# Altium project ZUM_Junior.PrjPcb
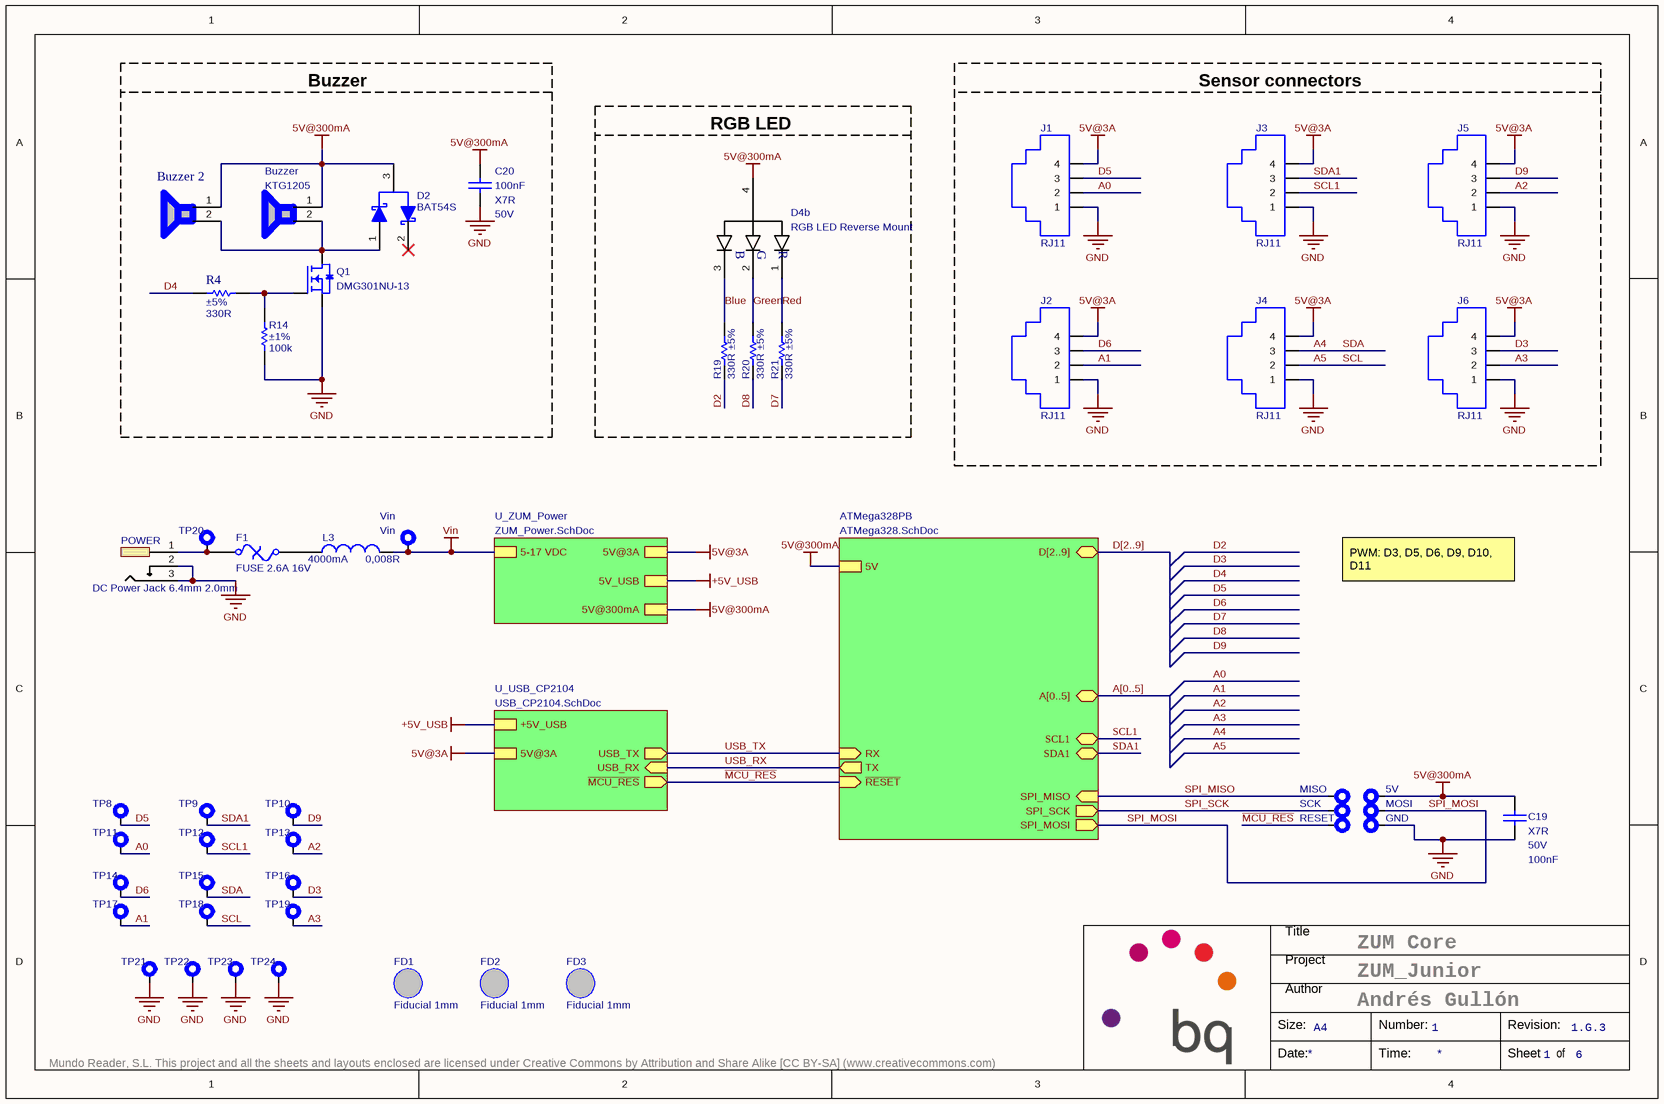
[diagram p0: ZUM_Junior.SchDoc]
ItemRevision: 1.G.3; ProjectName: ZUM_Junior; SilkscreenColor: White; SoldermaskColor: Blue; SurfaceFinish: Immersion Tin
6 sheets, 116 parts. Net scope: hierarchical (ports join the sheet entries above them; power ports are global).
Board file: ZUM_Junior.PcbDoc
Sheets:
  ZUM_Junior.SchDoc
    ATMega328PB = ATMega328.SchDoc
    U_USB_CP2104 = USB_CP2104.SchDoc
    U_ZUM_Power = ZUM_Power.SchDoc
      MP1477H_DCDC_5V = MP1477H_DCDC_5V.SchDoc
      MP2019_LDO_5V = MP2019_LDO_5V.SchDoc

## Sheet ZUM_Junior.SchDoc: ZUM Core
size A4; Author: Andrés Gullón; DocumentNumber: 1; Revision: 1.G.3; SheetNumber: 1; SheetTotal: 6

### Parts
Buzzer  KTG1205  [BUZZER SMD 13mm]
Buzzer_2  Buzzer 8.5mm SMD  [YX-8014S05-2.7]  (value not drawn)
C19  Dielectric: X7R  Voltage: 50V  Capacitance: 100nF  [C0603]  (hidden comment: C0603_100nF_50V_±10%_X7R)
C20  Dielectric: X7R  Voltage: 50V  Capacitance: 100nF  [C0603]  (hidden comment: C0603_100nF_50V_±10%_X7R)
D2  BAT54S  [SOT23-3]
D4b  RGB LED Reverse Mount  [LED1205 Reverse]
F1  FUSE 2.6A 16V  [F1812]
FD1  Fiducial 1mm  [Fiducial_1mm]  (no BOM)
FD2  Fiducial 1mm  [Fiducial_1mm]  (no BOM)
FD3  Fiducial 1mm  [Fiducial_1mm]  (no BOM)
J1  RJ11  [RJ11 SMD]
J2  RJ11  [RJ11 SMD]
J3  RJ11  [RJ11 SMD]
J4  RJ11  [RJ11 SMD]
J5  RJ11  [RJ11 SMD]
J6  RJ11  [RJ11 SMD]
L3  Resistance_DC: 0,008R  Current: 4000mA  [L0805]  (hidden comment: L0805_33R_0,008R_4000mA)
POWER  DC Power Jack 6.4mm 2.0mm  [694106106102]
Q1  DMG301NU-13  [SOT23-3]
R4  Tolerance: ±5%  Resistance: 330R  [R0402]  (hidden comment: R0402_330R_0.063W_±5%)
R14  Tolerance: ±1%  Resistance: 100k  [R0402]  (hidden comment: R0402_100k_0.063W_±1%)
R19  Tolerance: ±5%  Resistance: 330R  [R0402]  (hidden comment: R0402_330R_0.063W_±5%)
R20  Tolerance: ±5%  Resistance: 330R  [R0402]  (hidden comment: R0402_330R_0.063W_±5%)
R21  Tolerance: ±5%  Resistance: 330R  [R0402]  (hidden comment: R0402_330R_0.063W_±5%)
TP8  TP  [TP_POWER]  (value not drawn)  (no BOM)
TP9  TP  [TP_POWER]  (value not drawn)  (no BOM)
TP10  TP  [TP_POWER]  (value not drawn)  (no BOM)
TP11  TP  [TP_POWER]  (value not drawn)  (no BOM)
TP12  TP  [TP_POWER]  (value not drawn)  (no BOM)
TP13  TP  [TP_POWER]  (value not drawn)  (no BOM)
TP14  TP  [TP_POWER]  (value not drawn)  (no BOM)
TP15  TP  [TP_POWER]  (value not drawn)  (no BOM)
TP16  TP  [TP_POWER]  (value not drawn)  (no BOM)
TP17  TP  [TP_POWER]  (value not drawn)  (no BOM)
TP18  TP  [TP_POWER]  (value not drawn)  (no BOM)
TP19  TP  [TP_POWER]  (value not drawn)  (no BOM)
TP20  TP  [TP_POWER]  (value not drawn)  (no BOM)
TP21  TP  [TP_POWER]  (value not drawn)  (no BOM)
TP22  TP  [TP_POWER]  (value not drawn)  (no BOM)
TP23  TP  [TP_POWER]  (value not drawn)  (no BOM)
TP24  TP  [TP_POWER]  (value not drawn)  (no BOM)
TP25  MISO  [TP_POWER]  (no BOM)
TP26  5V  [TP_POWER]  (no BOM)
TP27  SCK  [TP_POWER]  (no BOM)
TP28  MOSI  [TP_POWER]  (no BOM)
TP29  GND  [TP_POWER]  (no BOM)
TP30  RESET  [TP_POWER]  (no BOM)
Vin  Vin  [TP_POWER]  (no BOM)

### Blocks framed on the sheet
Buzzer: Buzzer Buzzer_2 C20 D2 Q1 R4 R14
Sensor connectors: J1-J6
RGB LED: D4b R19-R21

### Sub-sheets
ATMega328PB = ATMega328.SchDoc: D[2..9] (bidir), A[0..5] (bidir), ~{RESET} (in), 5V, RX (in), TX (out), SPI_MOSI (out), SPI_MISO (in), SPI_SCK (out), SCL1 (bidir), SDA1 (bidir)
U_USB_CP2104 = USB_CP2104.SchDoc: ~{MCU_RES} (out), USB_TX (out), USB_RX (in), +5V_USB, 5V@3A
U_ZUM_Power = ZUM_Power.SchDoc: 5V@3A, 5V_USB, 5-17 VDC, 5V@300mA

### Nets
5V@3A: J1.4 J2.4 J3.4 J4.4 J5.4 J6.4 ; sheet U_USB_CP2104/5V@3A, sheet U_ZUM_Power/5V@3A
5V@300mA: Buzzer.1 Buzzer_2.1 C19.2 C20.2 D2.3(K1) D4b.4 TP26.1 ; sheet ATMega328PB/5V, sheet U_ZUM_Power/5V@300mA  [project net 5V]
+5V_USB: sheet U_USB_CP2104/+5V_USB, sheet U_ZUM_Power/5V_USB
GND: C19.1 C20.1 J1.1 J2.1 J3.1 J4.1 J5.1 J6.1 POWER.2 POWER.3 Q1.2(S) R14.1 TP21.1 TP22.1 TP23.1 TP24.1 TP29.1
Vin: L3.2 Vin.1 ; sheet U_ZUM_Power/5-17 VDC
A0: J1.2 TP11.1
A1: J2.2 TP17.1
A2: J5.2 TP13.1
A3: J6.2 TP19.1
A4: J4.3 TP15.1  [also labelled SDA]
A5: J4.2 TP18.1  [also labelled SCL]
Blue: D4b.3(B) R19.2
D2: R19.1
D3: J6.3 TP16.1
D4: R4.1
D5: J1.3 TP8.1
D6: J2.3 TP14.1
D7: R21.1
D8: R20.1
D9: J5.3 TP10.1
Green: D4b.2(R) R20.2
~{MCU_RES}: TP30.1 ; sheet ATMega328PB/~{RESET}, sheet U_USB_CP2104/~{MCU_RES}
Red: D4b.1(G) R21.2
SCL1: J3.2 TP12.1 ; sheet ATMega328PB/SCL1
SDA1: J3.3 TP9.1 ; sheet ATMega328PB/SDA1
SPI_MISO: TP25.1 ; sheet ATMega328PB/SPI_MISO
SPI_MOSI: TP28.1 ; sheet ATMega328PB/SPI_MOSI
SPI_SCK: TP27.1 ; sheet ATMega328PB/SPI_SCK
USB_RX: sheet ATMega328PB/TX, sheet U_USB_CP2104/USB_RX  [project net TX]
USB_TX: sheet ATMega328PB/RX, sheet U_USB_CP2104/USB_TX  [project net RX]
NetBuzzer_2: Buzzer.2 Buzzer_2.2 D2.1(A) Q1.3(D)
NetF1_1: F1.1 POWER.1 TP20.1
NetF1_2: F1.2 L3.1
NetQ1_1: Q1.1(G) R4.2 R14.2

Not connected (* = marked no-connect by the designer): D2 2(K2)*

### Buses and harness runs
bus A[0..5] = sheet ATMega328PB/A[0..5]
bus D[2..9] = sheet ATMega328PB/D[2..9]

### Notes on the sheet
- PWM: D3, D5, D6, D9, D10, D11
- Title
- Project
- Size:
- Author
- A4
- Number:
- Revision:
- Mundo Reader, S.L. This project and all the sheets and layouts enclosed are licensed under Creative Commons by Attribution and Share Alike [CC BY-SA] (www.creativecommons.com)
- Date:
- Time:
- Sheet
- of

### Library data of the parts
Buzzer = CMP-00356-1: Buzzer; Manufacturer: Kingstate Elect.; Description ES: Zumbador; Temp_Max: 85; Temp_Min: 30; SchLibComponentName: BUZZER; Part Number: KTG1205; OrderingCode: KTG1205; Price units: EUR
Buzzer_2 = CMP-00368-3: Manufacturer: Qinlon; Description ES: Zumbador SMD 9.5mm; OrderingCode: YX-8014S-05; Temp_Max: 70; Temp_Min: -30; Part Number: YX-8014S-05; Value: Buzzer
C19 C20 = CMP-00257-1: Manufacturer: Kemet; Description ES: Condensador; OrderingCode: C0603C104K5RAC; OrderingCode 2: 06035C104KAT2A; SchLibComponentName: Capacitor; Temp_ Max: 125; Temp_ Min: -55; Tolerance: ±10%; Value: 100nF ±10% 50V; Manufacturer 2: AVX; Part Number: C0603_100nF_50V_±10%_X7R; Price units: EUR
D2 = CMP-A2299-1: Schottky Diode; Manufacturer: NXP; SchLibComponentName: Dual Schottky; Ifor: 200mA; Vrrm: 30V; Ifsm: 600mA; Vf: 0,8V; Description ES: Diodo Schottky; Temp_Max: 150; Temp_Min: -55; Lead time: 8 wks; Value: 200mA 30V; Part Number: BAT54S; OrderingCode: BAT54S; Supplier cod: AC1190; Price units: EUR; Manufacturer 2: Vishay; OrderingCode 2: BAT54S
D4b = CMP-00366-1: Manufacturer: WÜrth Elektronik; Description ES: LED RGB Montado del revés; OrderingCode: 156125M173000; Temp_Max: 85; Temp_Min: -40; Value: RGB LED Rev.; Part Number: RGB LED Reverse
F1 = CMP-A2427-2: Resettable Fuses; Part Number: FUSE 2.5A 16V; Manufacturer: Bel Fuse; Current: 2.5A; OrderingCode: 0ZCG0260BF2B; Description ES: Fusible reseteable; Temp_ Max: 85; Temp_ Min: -40; Lead time: 12 wks; OrderingCode 2: MINISMDC260F/16-2; OrderingCode 3: MF-MSMF250/16X-2; SchLibComponentName: PTC_Fuse; Voltage: 16V; Price units: EUR; Manufacturer 2: Littelfuse; Manufacturer 3: Bourns
FD1-FD3 = CMP-A2525-2: Fiducial; Description ES: Marca fiducial; SchLibComponentName: Fiducial; Part Number: Fiducial 1mm
J1-J6 = CMP-00353-5: RJ11 4p4c SMD; Manufacturer: Kycon; OrderingCode: GMX-SMT2-N-44-TR; OrderingCode 2: 7641 – T441; OrderingCode 4: 95501-6449; Temp_Max: 85; Temp_Min: -40; Description ES: RJ11 4p4c SMD; Manufacturer 2: Cenvalsa; Manufacturer 4: Molex; Part Number: RJ11; Price units: EUR
L3 = CMP-A0714-1: Manufacturer: Würth Elektronik; SchLibComponentName: Ferrite Bead; Resistance_100MHz: 33R; OrderingCode: 742792012; Temp_ Max: 125; Temp_ Min: -55; Value: 33R 0,008R 4000mA; Part Number: L0805_33R_0,008R_4000mA; Price units: EUR
POWER = CMP-00354-1: Manufacturer: Würth Elektronik; Temp_Max: 85; Temp_Min: -40; Value: DC Jack; Description ES: DC Power Jack 6.4mm 2.0mm; OrderingCode: 694106106102; Part Number: 694106106102; Price units: €
Q1 = CMP-A2386-5: N-MOSFET transistor; Manufacturer: Diodes; Vds: 25V; Vgss: 8V; Id: 0,26A; Description ES: Transistor MOSFET de canal N; Temp_ Max: 150; Temp_ Min: -55; SchLibComponentName: Mosfet_N; Part Number: DMG301NU-13; OrderingCode: DMG301NU-13; Price units: EUR
R4 R19-R21 = CMP-A1762-2: Manufacturer: Vishay; OrderingCode: CRCW0402330RJN; Power: 0.063W; Value: 330R ±5% 0.063W; Temp_ Max: 155; Temp_ Min: -55; Description ES: Resistencia; SchLibComponentName: Resistor; PackageDescription: SMD; Part Number: R0402_330R_0.063W_±5%; Price units: EUR
R14 = CMP-A1835-2: Manufacturer: Vishay; Value: 100k ±1% 0.063W; SchLibComponentName: Resistor; OrderingCode: CRCW0402100KFK; Power: 0.063W; Temp_ Max: 155; Temp_ Min: -55; Description ES: Resistencia; PackageDescription: SMD; Part Number: R0402_100k_0.063W_±1%; Price units: EUR
TP8-TP30 Vin = CMP-A2499-3: Testpoint 0.3mm; Manufacturer: Oxley; OrderingCode: SMOX/060/B1; SAP: 303552; SchLibComponentName: Testpoint; Part Number: TP_POWER; Price units: EUR

## Sheet ATMega328.SchDoc: ATMega328-PB
size A4; Author: Andrés Gullón; DocumentNumber: 2; Revision: 1.G.3; SheetNumber: 2; SheetTotal: 6
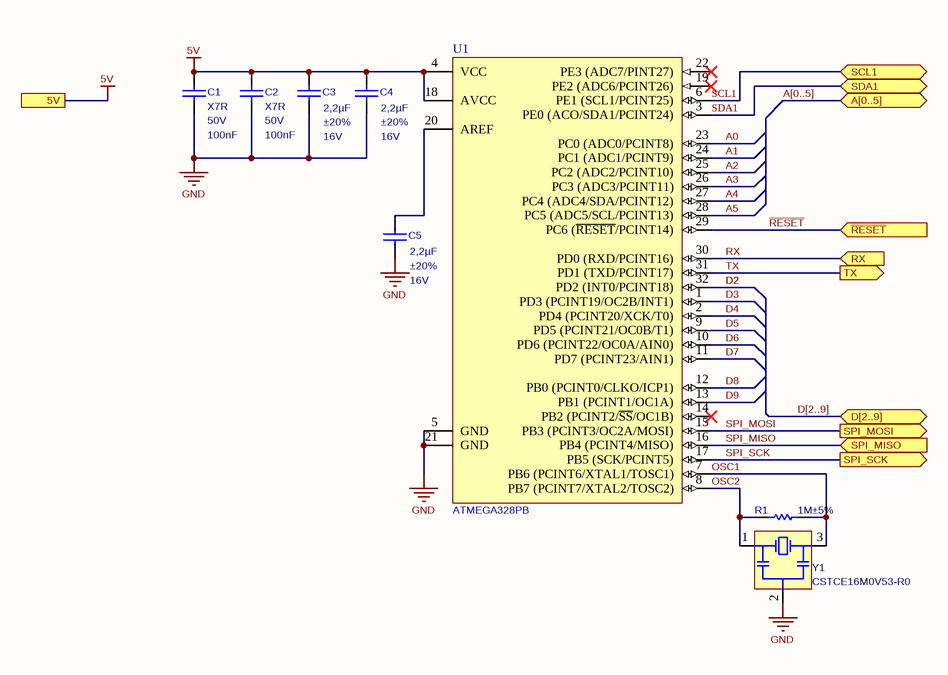
[diagram p1: ATMega328.SchDoc]

### Parts
C1  Dielectric: X7R  Voltage: 50V  Capacitance: 100nF  [C0603]  (hidden comment: C0603_100nF_50V_±10%_X7R)
C2  Dielectric: X7R  Voltage: 50V  Capacitance: 100nF  [C0603]  (hidden comment: C0603_100nF_50V_±10%_X7R)
C3  Voltage: 16V  Capacitance: 2,2µF  Tolerance: ±20%  [C0402]  (hidden comment: C0402_2.2uF_16V_±20%)
C4  Voltage: 16V  Capacitance: 2,2µF  Tolerance: ±20%  [C0402]  (hidden comment: C0402_2.2uF_16V_±20%)
C5  Voltage: 16V  Capacitance: 2,2µF  Tolerance: ±20%  [C0402]  (hidden comment: C0402_2.2uF_16V_±20%)
R1  Tolerance: ±5%  Resistance: 1M  [R0603]  (hidden comment: R0603_1M_0.1W_±5%)
U1  ATMEGA328PB  [TQFP32]
Y1  CSTCE16M0V53-R0  [Resonator_1.3x3.2]

### Ports
5V, A[0..5] (bidir), D[2..9] (bidir), RX (in), SCL1 (bidir), SDA1 (bidir), SPI_MISO (in), SPI_MOSI (out), SPI_SCK (out), TX (out), ~{RESET} (in)

### Nets
5V: C1.2 C2.2 C3.2 C4.2 U1.4(VCC) U1.18(AVCC) ; port 5V
GND: C1.1 C2.1 C3.1 C4.1 C5.1 U1.5(GND) U1.21(GND) Y1.2(GND)
A0: U1.23(PC0_(ADC0/PCINT8))
A1: U1.24(PC1_(ADC1/PCINT9))
A2: U1.25(PC2_(ADC2/PCINT10))
A3: U1.26(PC3_(ADC3/PCINT11))
A4: U1.27(PC4_(ADC4/SDA/PCINT12))
A5: U1.28(PC5_(ADC5/SCL/PCINT13))
D2: U1.32(PD2_(INT0/PCINT18))
D3: U1.1(PD3_(PCINT19/OC2B/INT1))
D4: U1.2(PD4_(PCINT20/XCK/T0))
D5: U1.9(PD5_(PCINT21/OC0B/T1))
D6: U1.10(PD6_(PCINT22/OC0A/AIN0))
D7: U1.11(PD7_(PCINT23/AIN1))
D8: U1.12(PB0_(PCINT0/CLKO/ICP1))
D9: U1.13(PB1_(PCINT1/OC1A))
OSC1: R1.1 U1.7(PB6_(PCINT6/XTAL1/TOSC1)) Y1.3(OSC2)
OSC2: R1.2 U1.8(PB7_(PCINT7/XTAL2/TOSC2)) Y1.1(OSC1)
~{RESET}: U1.29(PC6_(~{RESET}/PCINT14)) ; port ~{RESET}  [project net ~{MCU_RES}]
RX: U1.30(PD0_(RXD/PCINT16)) ; port RX
SCL1: U1.6(PE1_(SCL1/PCINT25)) ; port SCL1
SDA1: U1.3(PE0_(ACO/SDA1/PCINT24)) ; port SDA1
SPI_MISO: U1.16(PB4_(PCINT4/MISO)) ; port SPI_MISO
SPI_MOSI: U1.15(PB3_(PCINT3/OC2A/MOSI)) ; port SPI_MOSI
SPI_SCK: U1.17(PB5_(SCK/PCINT5)) ; port SPI_SCK
TX: U1.31(PD1_(TXD/PCINT17)) ; port TX
NetC5_2: C5.2 U1.20(AREF)

Not connected (* = marked no-connect by the designer): U1 14(PB2_(PCINT2/~{SS}/OC1B))* 19(PE2_(ADC6/PCINT26))* 22(PE3_(ADC7/PINT27))*

### Buses and harness runs
bus A[0..5] = port A[0..5]
bus D[2..9] = port D[2..9]

### Notes on the sheet
- Title
- Project
- Size:
- Author
- A4
- Number:
- Revision:
- Mundo Reader, S.L. This project and all the sheets and layouts enclosed are licensed under Creative Commons by Attribution and Share Alike [CC BY-SA] (www.creativecommons.com)
- Date:
- Time:
- Sheet
- of

### Library data of the parts
C1 C2 = CMP-00257-1: as C19 on sheet ZUM_Junior; Manufacturer 2: AVX; Part Number: C0603_100nF_50V_±10%_X7R; Price units: EUR
C3-C5 = CMP-A0550-4: C0402_2.2uF_16V_±20%_X5R; Part Number: C0402_2.2uF_16V_±10%; Manufacturer: TDK; Value: 2,2µF ±20% 16V; Dielectric: X5R; OrderingCode: C1005X5R1C225M050BC; Temp_ Max: 125; Temp_ Min: -55; AccessRights: 2147483647; ContentType: Component; Description ES: Condensador; Folder: Components Library\Pasives\Capacitor_SMD\C0402_16V$\; OrderingCode 2: EMK105ABJ225MV-F; RevisionId: 3; SchLibComponentName: Capacitor; Price units: EUR; ComponentType: Capacitor; ContentTypeGUID: CB3C11C4-E317-11DF-B822-12313F0024A2; FolderGUID: B1BE7916-43F7-4918-A273-F24409A7170B; ItemGUID: BD471B44-C1FF-4F80-85CC-AC0CC62DE9EE; ItemHRID: CMP-A0550; LifeCycle: New From Design; LifeCycleStateGUID: 706004B5-C76E-482E-903B-BA0E4FAE086A; Manufacturer 2: Taiyo Yuden; ReleaseDate: 04/09/2017 08:02:11 AM
R1 = CMP-A1358-3: Manufacturer: Vishay; OrderingCode: CRCW06031M00JN; Power: 0.1W; Value: 1M ±5% 0.1W; Temp_ Max: 155; Temp_ Min: -55; Description ES: Resistencia; SchLibComponentName: Resistor; PackageDescription: SMD; Part Number: R0603_1M_0.1W_±5%; Price units: EUR
U1 = CMP-00141-3: 8-bit Microcontrollers - MCU 32KB In-system Flash 20MHz 1.8V-5.5V; Manufacturer: Atmel; OrderingCode: ATMEGA328PB-AU; Description ES: Microcontrolador 8 bits; 32kB de memoria; Temp_ Max: 85; Temp_ Min: -40; Lead time: 3 wks; SchLibComponentName: ATMEGA328PB; Part Number: ATMEGA328PB; Supplier cod: AC1209; Price units: EUR
Y1 = CMP-A2241-1: Resonator 16MHz; Manufacturer: Murata; Description ES: Resonador 16MHz; Temp_Max: 80; Temp_Min: -20; Lead time: 10 wks; SchLibComponentName: Resonator 3 pin; Part Number: CSTCE16M0V53-R0; OrderingCode: CSTCE16M0V53-R0; Price units: EUR; Value: 16MHz

## Sheet USB_CP2104.SchDoc: CP2104 USB to Serial
size A4; Author: Andrés Gullón; DocumentNumber: 3; Revision: 1.G.3; SheetNumber: 3; SheetTotal: 6
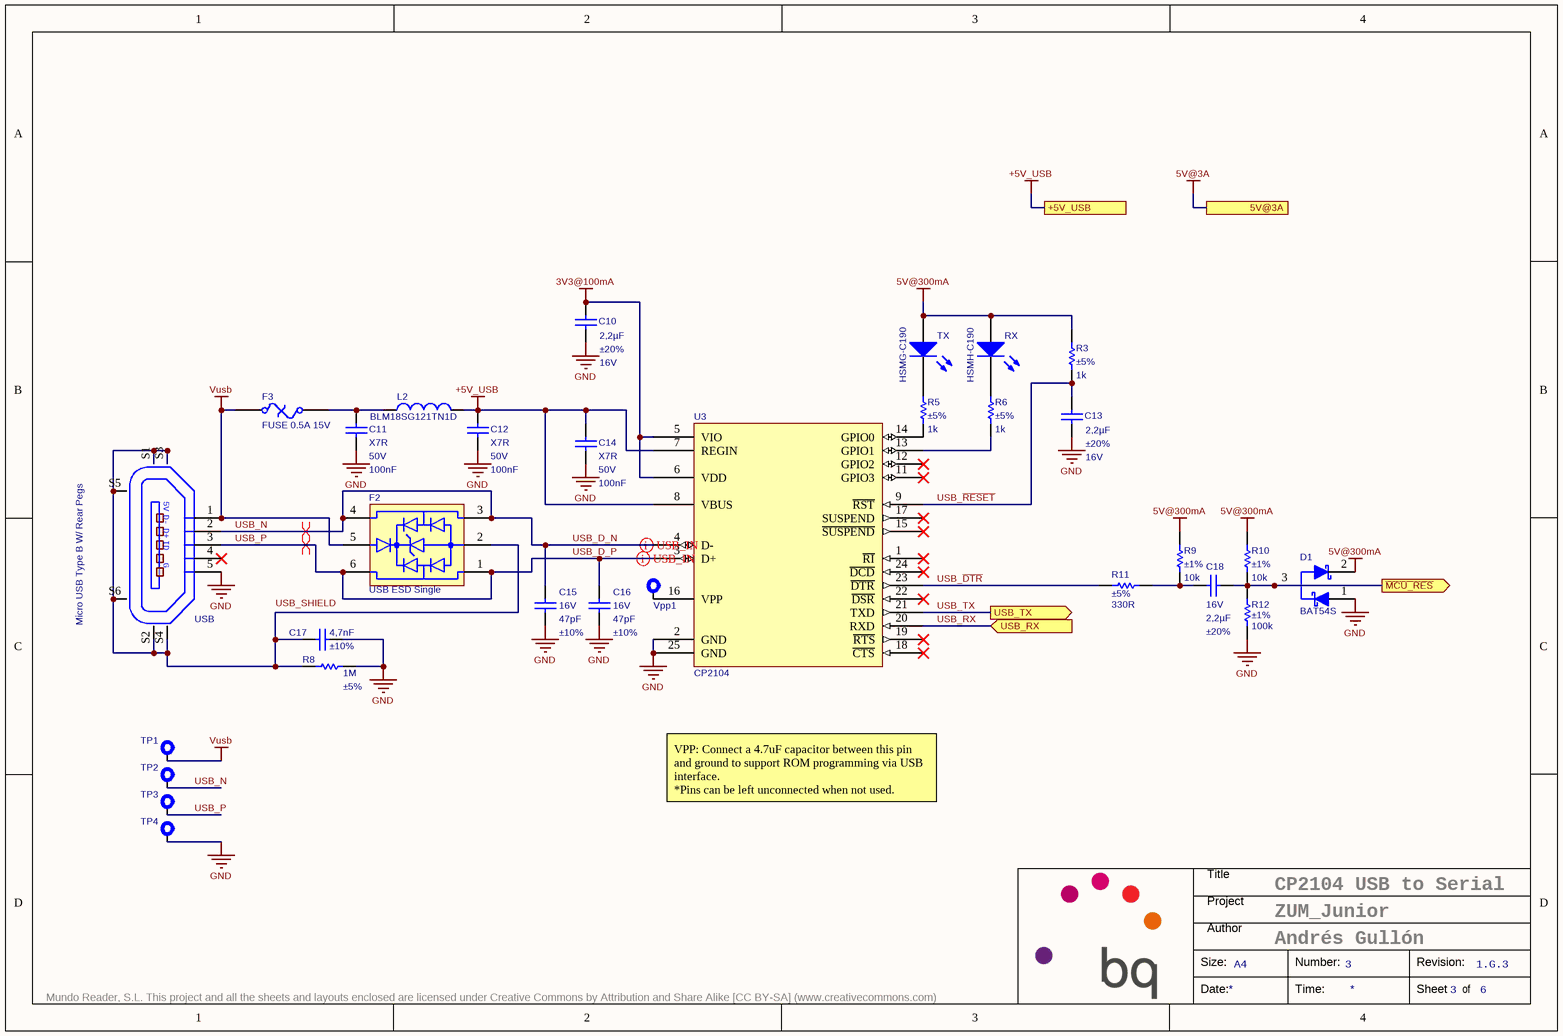
[diagram p2: USB_CP2104.SchDoc]

### Parts
C10  Voltage: 16V  Capacitance: 2,2µF  Tolerance: ±20%  [C0402]  (hidden comment: C0402_2.2uF_16V_±20%)
C11  Dielectric: X7R  Voltage: 50V  Capacitance: 100nF  [C0603]  (hidden comment: C0603_100nF_50V_±10%_X7R)
C12  Dielectric: X7R  Voltage: 50V  Capacitance: 100nF  [C0603]  (hidden comment: C0603_100nF_50V_±10%_X7R)
C13  Voltage: 16V  Capacitance: 2,2µF  Tolerance: ±20%  [C0402]  (hidden comment: C0402_2.2uF_16V_±20%)
C14  Dielectric: X7R  Voltage: 50V  Capacitance: 100nF  [C0603]  (hidden comment: C0603_100nF_50V_±10%_X7R)
C15  Voltage: 16V  Capacitance: 47pF  Tolerance: ±10%  [C0402]  (hidden comment: C0402_47pF_16V_±10%)
C16  Voltage: 16V  Capacitance: 47pF  Tolerance: ±10%  [C0402]  (hidden comment: C0402_47pF_16V_±10%)
C17  Capacitance: 4,7nF  Tolerance: ±10%  [C0805]  (hidden comment: C0805_4700pF_250V_±10%_X7R)
C18  Voltage: 16V  Capacitance: 2,2µF  Tolerance: ±20%  [C0402]  (hidden comment: C0402_2.2uF_16V_±20%)
D1  BAT54S  [SOT23-3]
F2  USB ESD Single  [SOT563]
F3  FUSE 0.5A 15V  [F1812]
L2  OrderingCode: BLM18SG121TN1D  [L0603]  (hidden comment: L0603_120R_0,025R_3000mA)
R3  Tolerance: ±5%  Resistance: 1k  [R0402]  (hidden comment: R0402_1k_0.063W_±5%)
R5  Tolerance: ±5%  Resistance: 1k  [R0402]  (hidden comment: R0402_1k_0.063W_±5%)
R6  Tolerance: ±5%  Resistance: 1k  [R0402]  (hidden comment: R0402_1k_0.063W_±5%)
R8  Tolerance: ±5%  Resistance: 1M  [R0603]  (hidden comment: R0603_1M_0.1W_±5%)
R9  Tolerance: ±1%  Resistance: 10k  [R0402]  (hidden comment: R0402_10k_0.063W_±1%)
R10  Tolerance: ±1%  Resistance: 10k  [R0402]  (hidden comment: R0402_10k_0.063W_±1%)
R11  Tolerance: ±5%  Resistance: 330R  [R0402]  (hidden comment: R0402_330R_0.063W_±5%)
R12  Tolerance: ±1%  Resistance: 100k  [R0402]  (hidden comment: R0402_100k_0.063W_±1%)
RX  HSMH-C190  [LED0603]
TP1  TP  [TP_POWER]  (value not drawn)  (no BOM)
TP2  TP_POWER  [TP_POWER]  (value not drawn)  (no BOM)
TP3  TP_POWER  [TP_POWER]  (value not drawn)  (no BOM)
TP4  TP_POWER  [TP_POWER]  (value not drawn)  (no BOM)
TX  HSMG-C190  [LED0603]
U3  CP2104  [QFN24_no_power]
USB  Micro USB Type B W/ Rear Pegs  [USB_B_W_REAR_PEGS]
Vpp1  TP_POWER  [TP_POWER]  (value not drawn)  (no BOM)

### Ports
5V@3A, +5V_USB, USB_RX (in), USB_TX (out), ~{MCU_RES} (out)

### Nets
3V3@100mA: C10.2 U3.5(VIO) U3.6(VDD)
5V@300mA: D1.2(K2) R3.2 R9.1 R10.1 RX.A TX.A  [project net 5V]
+5V_USB: C12.2 C14.2 L2.2 U3.7(REGIN) U3.8(VBUS) ; port +5V_USB
GND: C10.1 C11.1 C12.1 C13.1 C14.1 C15.1 C16.1 C17.2 D1.1(A) R8.1 R12.2 TP4.1 U3.2(GND) U3.25(GND) USB.5(P5)
Vusb: F2.5 F3.1 TP1.1 USB.1(P1)
~{MCU_RES}: C18.1 D1.3(K1) R10.2 R12.1 ; port ~{MCU_RES}
USB_~{DTR}: R11.1 U3.23(~{DTR})
USB_D_N: C15.2 F2.3 F2.4 TP2.1 U3.4(D-) USB.2(P2)  [also labelled USB_N]
USB_D_P: C16.2 F2.1 F2.6 TP3.1 U3.3(D+) USB.3(P3)  [also labelled USB_P]
USB_~{RESET}: C13.2 R3.1 U3.9(~{RST})
USB_RX: U3.20(RXD) ; port USB_RX  [project net TX]
USB_TX: U3.21(TXD) ; port USB_TX  [project net RX]
NetC11_2: C11.2 F3.2 L2.1
NetC17_1: C17.1 F2.2 R8.2 USB.S1(SHLD1) USB.S2(SHLD2) USB.S3(SHLD3) USB.S4(SHLD4) USB.S5(SHLD5) USB.S6(SHLD6)
NetC18_2: C18.2 R9.2 R11.2
NetR5_1: R5.1 U3.14(GPIO0)
NetR5_2: R5.2 TX.K
NetR6_1: R6.1 U3.13(GPIO1)
NetR6_2: R6.2 RX.K
NetU3_16: U3.16(VPP) Vpp1.1

Not connected (* = marked no-connect by the designer): U3 1(~{RI})* 11(GPIO3)* 12(GPIO2)* 15(~{SUSPEND})* 17(SUSPEND)* 18(~{CTS})* 19(~{RTS})* 22(~{DSR})* 24(~{DCD})*; USB 4(P4)*

### Layout directives
differential pair: USB_D_N, USB_D_P

### Notes on the sheet
- VPP: Connect a 4.7uF capacitor between this pin and ground to support ROM programming via USB interface.
  *Pins can be left unconnected when not used.
- Labels drawn without touching a wire or pin: USB_SHIELD
- Title
- Project
- Size:
- Author
- A4
- Number:
- Revision:
- Mundo Reader, S.L. This project and all the sheets and layouts enclosed are licensed under Creative Commons by Attribution and Share Alike [CC BY-SA] (www.creativecommons.com)
- Date:
- Time:
- Sheet
- of
- (in symbol CMP-A2224-4) 5V; D-; D+; ID; G

### Library data of the parts
C10 C13 C18 = CMP-A0550-4: as C3 on sheet ATMega328; SchLibComponentName: Capacitor; Price units: EUR; ComponentType: Capacitor; ContentTypeGUID: CB3C11C4-E317-11DF-B822-12313F0024A2; FolderGUID: B1BE7916-43F7-4918-A273-F24409A7170B; ItemGUID: BD471B44-C1FF-4F80-85CC-AC0CC62DE9EE; ItemHRID: CMP-A0550; LifeCycle: New From Design; LifeCycleStateGUID: 706004B5-C76E-482E-903B-BA0E4FAE086A; Manufacturer 2: Taiyo Yuden; ReleaseDate: 04/09/2017 08:02:11 AM
C11 C12 C14 = CMP-00257-1: as C19 on sheet ZUM_Junior; Manufacturer 2: AVX; Part Number: C0603_100nF_50V_±10%_X7R; Price units: EUR
C15 C16 = CMP-A0572-2: Manufacturer: Kemet; Value: 47pF ±10% 16V; Dielectric: C0G; OrderingCode: C0402C470K4GAC; Temp_ Max: 125; Temp_ Min: -55; AccessRights: 2147483647; ContentType: Component; Description ES: Condensador; Folder: Components Library\Pasives\Capacitor_SMD\C0402_16V$\; RevisionId: 1; SchLibComponentName: Capacitor; Part Number: C0402_47pF_16V_±10%; Price units: EUR; ComponentType: Capacitor; ContentTypeGUID: CB3C11C4-E317-11DF-B822-12313F0024A2; FolderGUID: B1BE7916-43F7-4918-A273-F24409A7170B; ItemGUID: BA17F97B-A8F2-4344-A89B-4AB43394B9E9; ItemHRID: CMP-A0572; LifeCycle: New From Design; LifeCycleStateGUID: 706004B5-C76E-482E-903B-BA0E4FAE086A; ReleaseDate: 19/02/2016 10:21:00 AM
C17 = CMP-A0234-3: Manufacturer: TDK; Value: 4,7nF ±10% 250V; Dielectric: X7R; Voltage: 250V; OrderingCode: C2012X7R2E472K085AM; Temp_ Max: 125; Temp_ Min: -55; Description ES: Condensador; SchLibComponentName: Capacitor; Part Number: C0805_4700pF_250V_±10%; Price units: EUR
D1 = CMP-A2299-1: as D2 on sheet ZUM_Junior; Part Number: BAT54S; OrderingCode: BAT54S; Supplier cod: AC1190; Price units: EUR; Manufacturer 2: Vishay; OrderingCode 2: BAT54S
F2 = CMP-A2443-2: TVS Diode Array; Manufacturer: Würth Elektronik; OrderingCode: 82400152; Description ES: Array de diodos TVS; Temp_ Max: 125; Temp_ Min: -40; Lead time: 5 wks; OrderingCode 2: CDSOT563-0502; SchLibComponentName: ESDUSB; Part Number: USB ESD Single; Price units: EUR; Manufacturer 2: Bourns
F3 = CMP-A2421-1: Resettable Fuses; Manufacturer: Bourns; OrderingCode: MF-MSMF050-2; Description ES: Fusible reseteable; Temp_ Max: 85; Temp_ Min: -40; Lead time: 11 wks; SchLibComponentName: PTC_Fuse; Part Number: FUSE 0.5A 15V; Voltage: 15V; Current: 0.5A; Price units: EUR
L2 = CMP-A0708-2: Manufacturer: Murata; Resistance_100MHz: 120R; Resistance_DC: 0,025R; Current: 3000mA; Temp_ Max: 125; Temp_ Min: -55; Value: 120R 0,025R 3000mA; Description ES: Ferrita; SchLibComponentName: Ferrite Bead; Part Number: L0603_120R_0,025R_3000mA; Price units: EUR
R3 R5 R6 = CMP-A1718-3: Manufacturer: Vishay; OrderingCode: CRCW04021K00JN; Power: 0.063W; Value: 1k ±5% 0.063W; Temp_ Max: 155; Temp_ Min: -55; Description ES: Resistencia; SchLibComponentName: Resistor; PackageDescription: SMD; Part Number: R0402_1k_0.063W_±5%; Price units: EUR
R8 = CMP-A1358-3: as R1 on sheet ATMega328; SchLibComponentName: Resistor; PackageDescription: SMD; Part Number: R0603_1M_0.1W_±5%; Price units: EUR
R9 R10 = CMP-A1837-1: Manufacturer: Vishay; SchLibComponentName: Resistor; OrderingCode: CRCW040210K0FK; Power: 0.063W; Value: 10k ±1% 0.063W; Temp_ Max: 155; Temp_ Min: -55; PackageDescription: SMD; Part Number: R0402_10k_0.063W_±1%; Price units: EUR
R11 = CMP-A1762-2: as R4 on sheet ZUM_Junior; SchLibComponentName: Resistor; PackageDescription: SMD; Part Number: R0402_330R_0.063W_±5%; Price units: EUR
R12 = CMP-A1835-2: as R14 on sheet ZUM_Junior; PackageDescription: SMD; Part Number: R0402_100k_0.063W_±1%; Price units: EUR
RX = CMP-A2546-1: LED; Manufacturer: Avago Technologies; Temp_ Max: 85; Temp_ Min: -40; Lead time: 4 wks; OrderingCode 2: LS Q976-NR-1; Value: Red; SchLibComponentName: LED; Part Number: HSMH-C190; OrderingCode: HSMH-C190; Description ES: LED; Price units: EUR; Manufacturer 2: OSRAM Opto
TP1-TP4 Vpp1 = CMP-A2499-3: as TP8 on sheet ZUM_Junior; SchLibComponentName: Testpoint; Part Number: TP_POWER; Price units: EUR
TX = CMP-A2544-1: LED; Manufacturer: Avago Technologies; Temp_ Max: 85; Temp_ Min: -40; Lead time: 5 wks; OrderingCode 2: LG Q971-KN-1; Value: Green; SchLibComponentName: LED; Part Number: HSMG-C190; OrderingCode: HSMG-C190; Description ES: LED; Price units: EUR; Manufacturer 2: OSRAM Opto
U3 = CMP-A2587-1: USB to UART Bridge; Manufacturer: Silicon Labs; OrderingCode: CP2104-F03-GMR; Description ES: Interfaz USB a UART; Temp_ Max: 85; Temp_ Min: -40; Lead time: 4 wks; SchLibComponentName: CP2104; Part Number: CP2104; Supplier cod: AC1190; Price units: EUR
USB = CMP-A2224-4: Manufacturer: FCI; OrderingCode: 10118194-0001LF; Description ES: Conector; Lead time: 10 wks; Temp_ Max: 105; Temp_ Min: -40; SchLibComponentName: USB_Micro_Type_B; Part Number: Micro USB Type B W/ Rear Pegs; Price units: EUR

## Sheet ZUM_Power.SchDoc: ZUM_Junior_Power
size A4; Author: Andrés Gullón; DocumentNumber: 4; Revision: 1.G.3; SheetNumber: 4; SheetTotal: 6
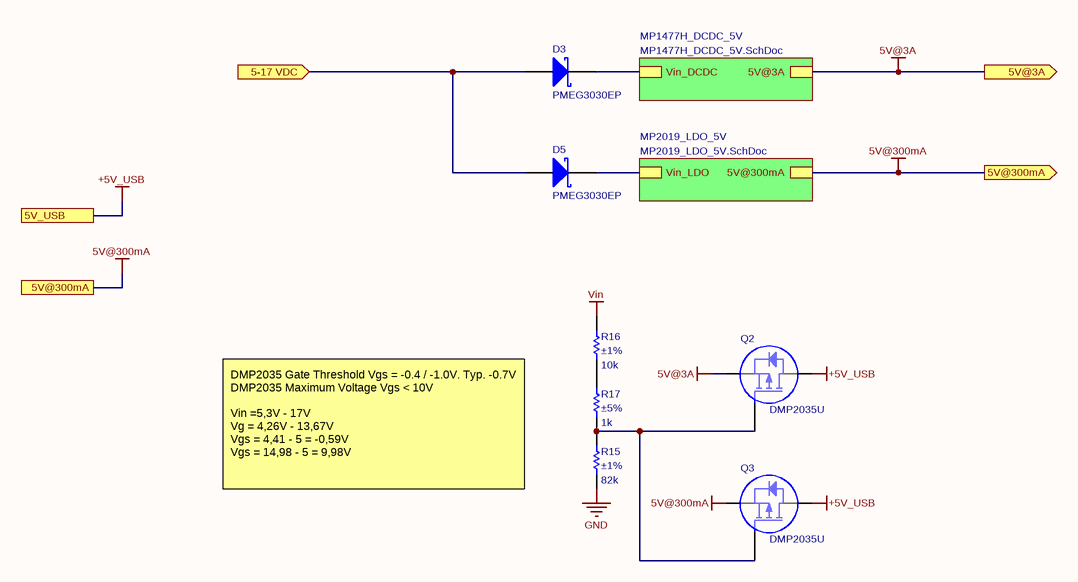
[diagram p3: ZUM_Power.SchDoc]

### Parts
D3  PMEG3030EP  [SOD128]
D5  PMEG3030EP  [SOD128]
Q2  DMP2035U  [SOT23-3]
Q3  DMP2035U  [SOT23-3]
R15  Tolerance: ±1%  Resistance: 82k  [R0402]  (hidden comment: R0402_82k_0.063W_±1%)
R16  Tolerance: ±1%  Resistance: 10k  [R0402]  (hidden comment: R0402_10k_0.063W_±1%)
R17  Tolerance: ±5%  Resistance: 1k  [R0402]  (hidden comment: R0402_1k_0.063W_±5%)

### Sub-sheets
MP1477H_DCDC_5V = MP1477H_DCDC_5V.SchDoc: Vin_DCDC, 5V@3A
MP2019_LDO_5V = MP2019_LDO_5V.SchDoc: Vin_LDO, 5V@300mA

### Ports
5-17 VDC (in), 5V@3A (out), 5V@300mA, 5V@300mA (out), 5V_USB

### Nets
5V@3A: Q2.2(S) ; port 5V@3A, sheet MP1477H_DCDC_5V/5V@3A
5V@300mA: Q3.2(S) ; port 5V@300mA, sheet MP2019_LDO_5V/5V@300mA  [project net 5V]
+5V_USB: Q2.3(D) Q3.3(D) ; port 5V_USB
GND: R15.1
Vin: D3.A D5.A R16.1 ; port 5-17 VDC
Vin_DCDC: D3.k(K) ; sheet MP1477H_DCDC_5V/Vin_DCDC
NetC23_2: D5.k(K) ; sheet MP2019_LDO_5V/Vin_LDO
NetQ2_1: Q2.1(G) Q3.1(G) R15.2 R17.1
NetR16_2: R16.2 R17.2

### Notes on the sheet
- DMP2035 Gate Threshold Vgs = -0.4 / -1.0V. Typ. -0.7V
  DMP2035 Maximum Voltage Vgs < 10V
  Vin =5,3V - 17V
  Vg = 4,26V - 13,67V
  Vgs = 4,41 - 5 = -0,59V
  Vgs = 14,98 - 5 = 9,98V
- Title
- Project
- Size:
- Author
- A4
- Number:
- Revision:
- Mundo Reader, S.L. This project and all the sheets and layouts enclosed are licensed under Creative Commons by Attribution and Share Alike [CC BY-SA] (www.creativecommons.com)
- Date:
- Time:
- Sheet
- of

### Library data of the parts
D3 D5 = CMP-A2309-1: Schottky Diode; Manufacturer: NXP; Ifor: 3A; Vrrm: 30V; Ifsm: 50A; Vf: 0,36V; Description ES: Diodo Schottky; Temp_Max: 150; Temp_Min: -55; Lead time: 3 wks; Value: 3A 30V; SchLibComponentName: Schottky; Part Number: PMEG3030EP; OrderingCode: PMEG3030EP; Price units: EUR
Q2 Q3 = CMP-A2378-1: P-MOSFET transistor; Manufacturer: Diodes Incorporated; SchLibComponentName: Mosfet_P; Vds: 20V; Vgss: 8V; Id: 3,6A; OrderingCode: DMP2035U-7; Description ES: Transistor MOSFET de canal P; Temp_ Max: 150; Temp_ Min: -55; Lead time: 6 wks; Part Number: DMP2035U; Supplier cod: AC1190; Price units: EUR
R15 = CMP-A1992-3: Manufacturer: Vishay; OrderingCode: CRCW040282K0FK; Power: 0.063W; Value: 82k ±1% 0.063W; Temp_ Max: 155; Temp_ Min: -55; Description ES: Resistencia; OrderingCode 2: RC0402FR-0782KL; SchLibComponentName: Resistor; PackageDescription: SMD; Part Number: R0402_82k_0.063W_±1%; Price units: EUR; Manufacturer 2: Yageo
R16 = CMP-A1837-1: as R9 on sheet USB_CP2104; PackageDescription: SMD; Part Number: R0402_10k_0.063W_±1%; Price units: EUR
R17 = CMP-A1718-3: as R3 on sheet USB_CP2104; SchLibComponentName: Resistor; PackageDescription: SMD; Part Number: R0402_1k_0.063W_±5%; Price units: EUR

## Sheet MP1477H_DCDC_5V.SchDoc: TPS62133 DCDC 5V@3A
size A4; Author: Andrés Gullón; DocumentNumber: 6; Revision: 1.G.3; SheetNumber: 6; SheetTotal: 6
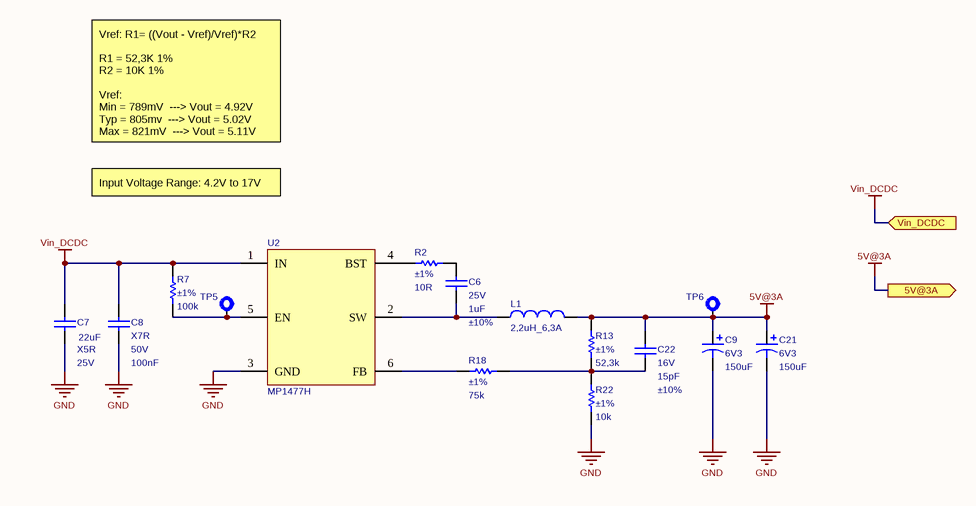
[diagram p4: MP1477H_DCDC_5V.SchDoc]

### Parts
C6  Voltage: 25V  Capacitance: 1uF  Tolerance: ±10%  [C0603]  (hidden comment: C0603_1uF_25V_±10%)
C7  Dielectric: X5R  Voltage: 25V  Capacitance: 22uF  [C1206]  (hidden comment: C1206_22uF_25V_±10%)
C8  Dielectric: X7R  Voltage: 50V  Capacitance: 100nF  [C0603]  (hidden comment: C0603_100nF_50V_±10%_X7R)
C9  Voltage: 6V3  Capacitance: 150uF  [CASE_B_3528-1411]  (hidden comment: 150uF_6V3_±20%)
C21  Voltage: 6V3  Capacitance: 150uF  [CASE_B_3528-1411]  (hidden comment: 150uF_6V3_±20%)
C22  Voltage: 16V  Capacitance: 15pF  Tolerance: ±10%  [C0402]  (hidden comment: C0402_15pF_16V_±10%_C0G)
L1  2,2uH_6,3A  [SRN8040]
R2  Tolerance: ±1%  Resistance: 10R  [R0402]  (hidden comment: R0402_10R_0.063W_±1%)
R7  Tolerance: ±1%  Resistance: 100k  [R0402]  (hidden comment: R0402_100k_0.063W_±1%)
R13  Tolerance: ±1%  Resistance: 52,3k  [R0402]  (hidden comment: R0402_52,3k_0.063W_±1%)
R18  Tolerance: ±1%  Resistance: 75k  [R0402]  (hidden comment: R0402_75k_0.063W_±1%)
R22  Tolerance: ±1%  Resistance: 10k  [R0402]  (hidden comment: R0402_10k_0.063W_±1%)
TP5  TP  [TP_POWER]  (value not drawn)  (no BOM)
TP6  TP  [TP_POWER]  (value not drawn)  (no BOM)
U2  MP1477H  [SOT-563 - MP1477H]

### Ports
5V@3A (out), Vin_DCDC (in)

### Nets
5V@3A: C9.1 C21.1 C22.2 L1.2 R13.1 TP6.1 ; port 5V@3A
GND: C7.1 C8.1 C9.2 C21.2 R22.2 U2.3(GND)
Vin_DCDC: C7.2 C8.2 R7.2 U2.1(IN) ; port Vin_DCDC
NetC6_1: C6.1 L1.1 U2.2(SW)
NetC6_2: C6.2 R2.2
NetC22_1: C22.1 R13.2 R18.2 R22.1
NetR2_1: R2.1 U2.4(BST)
NetR7_1: R7.1 TP5.1 U2.5(EN)
NetR18_1: R18.1 U2.6(FB)

### Notes on the sheet
- Input Voltage Range: 4.2V to 17V
- Vref: R1= ((Vout - Vref)/Vref)*R2
  R1 = 52,3K 1%
  R2 = 10K 1%
  Vref:
  Min = 789mV  ---> Vout = 4.92V
  Typ = 805mv  ---> Vout = 5.02V
  Max = 821mV  ---> Vout = 5.11V
- Title
- Project
- Size:
- Author
- A4
- Number:
- Revision:
- Mundo Reader, S.L. This project and all the sheets and layouts enclosed are licensed under Creative Commons by Attribution and Share Alike [CC BY-SA] (www.creativecommons.com)
- Date:
- Time:
- Sheet
- of

### Library data of the parts
C6 = CMP-A0371-1: Manufacturer: Kemet; Dielectric: X5R; Value: 1uF ±10% 25V; OrderingCode: C0603C105K3PAC; Temp_ Max: 125; Temp_ Min: -55; SchLibComponentName: Capacitor; Part Number: C0603_1uF_25V_±10%; Price units: EUR
C7 = CMP-A0110-1: Manufacturer: Murata; SchLibComponentName: Capacitor; Value: 22uF ±10% 25V; Tolerance: ±10%; OrderingCode: GRM31CR61E226KE15L; Temp_ Max: 85; Temp_ Min: -55; Part Number: C1206_22uF_25V_±10%; Price units: EUR
C8 = CMP-00257-1: as C19 on sheet ZUM_Junior; Manufacturer 2: AVX; Part Number: C0603_100nF_50V_±10%_X7R; Price units: EUR
C9 C21 = CMP-A2028-1: Manufacturer: Kemet; Value: 150uF ±20% 6V3; Tolerance: ±20%; ESR: 70m; OrderingCode: T520B157M006ATE070; Temp_ Max: 105; Temp_ Min: -55; SchLibComponentName: Tantalum; Part Number: 150uF_6V3_±20%; Price units: EUR
C22 = CMP-A0543-2: Manufacturer: Kemet; Dielectric: C0G; Value: 15pF ±10% 16V; OrderingCode: C0402C150K4GAC; Temp_ Max: 125; Temp_ Min: -55; Description ES: Condensador; SchLibComponentName: Capacitor; Part Number: C0402_15pF_16V_±10%; Price units: EUR
L1 = CMP-A0670-2: Semi-shielded power inductor; Manufacturer: Bourns; L: 2,2µH; Rdc: 0,013R; Current: 6,3A; Current Sat#: 7,3A; OrderingCode: SRN8040-2R2Y; Temp_ Max: 105; Temp_ Min: -40; Value: 2,2µH 6,3A; AccessRights: 2147483647; ContentType: Component; Current Sat.: 7,4A; Description ES: Bobina; Folder: Components Library\Pasives\Inductor_SMD\Power Inductor$\; RevisionId: 1; SchLibComponentName: Inductor; Part Number: 2,2uH_6,3A; Price units: EUR; ContentTypeGUID: CB3C11C4-E317-11DF-B822-12313F0024A2; FolderGUID: 60894C29-593F-4616-8F9E-CDB5863F0F96; ItemGUID: EAB2D04B-E49E-443A-801C-32E206E8EAE6; ItemHRID: CMP-A0670; LifeCycle: New From Design; LifeCycleStateGUID: 706004B5-C76E-482E-903B-BA0E4FAE086A; ReleaseDate: 19/02/2016 11:18:53 AM
R2 = CMP-A1838-2: Manufacturer: Vishay; Value: '=Resistance+' '+Tolerance+' '+Power; OrderingCode: CRCW040210R0FK; Power: 0.063W; Temp_ Max: 155; Temp_ Min: -55; Description ES: Resistencia; OrderingCode 2: RC0402FR-0710RL; Temp_Max: 155°C; Temp_Min: -55°C; SchLibComponentName: Resistor; PackageDescription: SMD; Part Number: R0402_10R_0.063W_±1%; Price units: EUR; Manufacturer 2: Yageo
R7 = CMP-A1835-2: Manufacturer: Vishay; Value: 100k ±1% 0.063W; OrderingCode: CRCW0402100KFK; Power: 0.063W; Description ES: Resistencia; Temp_ Max: 155; Temp_ Min: -55; SchLibComponentName: Resistor; PackageDescription: SMD; Part Number: R0402_100k_0.063W_±1%; Price units: EUR
R13 = CMP-A1961-1: Manufacturer: Vishay; Value: 52,3k ±1% 0.063W; OrderingCode: CRCW040252K3FK; Power: 0.063W; Temp_ Max: 155; Temp_ Min: -55; SchLibComponentName: Resistor; PackageDescription: SMD; Part Number: R0402_52,3k_0.063W_±1%; Price units: EUR
R18 = CMP-A1985-2: Manufacturer: Vishay; Value: 75k ±1% 0.063W; OrderingCode: CRCW040275K0FK; Power: 0.063W; Temp_ Max: 155; Temp_ Min: -55; Description ES: Resistencia; OrderingCode 2: RC0402FR-0775KL; Temp_Max: 155°C; Temp_Min: -55°C; SchLibComponentName: Resistor; PackageDescription: SMD; Part Number: R0402_75k_0.063W_±1%; Price units: EUR; Manufacturer 2: Yageo
R22 = CMP-A1837-1: Manufacturer: Vishay; Value: 10k ±1% 0.063W; OrderingCode: CRCW040210K0FK; Power: 0.063W; Temp_ Max: 155; Temp_ Min: -55; SchLibComponentName: Resistor; PackageDescription: SMD; Part Number: R0402_10k_0.063W_±1%; Price units: EUR
TP5 TP6 = CMP-A2499-3: as TP8 on sheet ZUM_Junior; SchLibComponentName: Testpoint; Part Number: TP_POWER; Price units: EUR
U2 = CMP-00385-3: DCDC Step Down Vout= 1-5V; Vin= 12-17V; Manufacturer: MPS; Description ES: Regulador de voltaje; OrderingCode: MP1477GTF-Z; Temp_Max: 125; Temp_Min: -40; Part Number: MP1477GTF-Z; Price units: EUR

## Sheet MP2019_LDO_5V.SchDoc: MP2019_LDO_5V@300mA
size A4; Author: Andrés Gullón; DocumentNumber: 5; Revision: 1.G.3; SheetNumber: 5; SheetTotal: 6
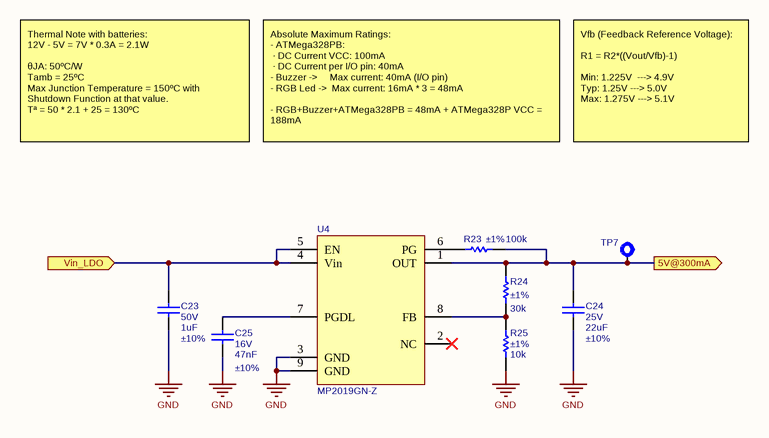
[diagram p5: MP2019_LDO_5V.SchDoc]

### Parts
C23  Voltage: 50V  Capacitance: 1uF  Tolerance: ±10%  [C0805]  (hidden comment: C0805_1uF_50V_±10%_X7R)
C24  Voltage: 25V  Capacitance: 22uF  Tolerance: ±10%  [C1206]  (hidden comment: C1206_22uF_25V_±10%)
C25  Voltage: 16V  Capacitance: 47nF  Tolerance: ±10%  [C0402]  (hidden comment: C0402_47nF_16V_±10%)
R23  Tolerance: ±1%  Resistance: 100k  [R0402]  (hidden comment: R0402_100k_0.063W_±1%)
R24  Tolerance: ±1%  Resistance: 30k  [R0402]  (hidden comment: R0402_30k_0.063W_±1%)
R25  Tolerance: ±1%  Resistance: 10k  [R0402]  (hidden comment: R0402_10k_0.063W_±1%)
TP7  TP  [TP_POWER]  (value not drawn)  (no BOM)
U4  MP2019GN-Z  [SOIC8 EP]

### Ports
5V@300mA (out), Vin_LDO (in)

### Nets
5V: C24.2 R23.1 R24.2 TP7.1 U4.1(OUT) ; port 5V@300mA
GND: C23.1 C24.1 C25.1 R25.2 U4.3(GND) U4.9(GND)
NetC23_2: C23.2 U4.4(Vin) U4.5(EN) ; port Vin_LDO
NetC25_2: C25.2 U4.7(PGDL)
NetR23_2: R23.2 U4.6(PG)
NetR24_1: R24.1 R25.1 U4.8(FB)

Not connected (* = marked no-connect by the designer): U4 2(NC)*

### Notes on the sheet
- Thermal Note with batteries:
  12V - 5V = 7V * 0.3A = 2.1W
  θJA: 50ºC/W
  Tamb = 25ºC
  Max Junction Temperature = 150ºC with Shutdown Function at that value.
  Tª = 50 * 2.1 + 25 = 130ºC
- Absolute Maximum Ratings:
  - ATMega328PB:
  · DC Current VCC: 100mA
  · DC Current per I/O pin: 40mA
  - Buzzer ->     Max current: 40mA (I/O pin)
  - RGB Led ->  Max current: 16mA * 3 = 48mA
  - RGB+Buzzer+ATMega328PB = 48mA + ATMega328P VCC = 188mA
- Vfb (Feedback Reference Voltage):
  R1 = R2*((Vout/Vfb)-1)
  Min: 1.225V  ---> 4.9V
  Typ: 1.25V ---> 5.0V
  Max: 1.275V ---> 5.1V
- Title
- Project
- Size:
- Author
- A4
- Number:
- Revision:
- Mundo Reader, S.L. This project and all the sheets and layouts enclosed are licensed under Creative Commons by Attribution and Share Alike [CC BY-SA] (www.creativecommons.com)
- Date:
- Time:
- Sheet
- of

### Library data of the parts
C23 = CMP-A0195-2: Manufacturer: Kemet; Dielectric: X7R; Value: 1uF ±10% 50V; OrderingCode: C0805C105K5RAC; Temp_ Max: 125; Temp_ Min: -55; Description ES: Condensador; SchLibComponentName: Capacitor; Part Number: C0805_1uF_50V_±10%_X7R; Price units: EUR
C24 = CMP-A0110-1: Manufacturer: Murata; Dielectric: X5R; Value: 22uF ±10% 25V; OrderingCode: GRM31CR61E226KE15L; Temp_ Max: 85; Temp_ Min: -55; SchLibComponentName: Capacitor; Part Number: C1206_22uF_25V_±10%; Price units: EUR
C25 = CMP-A0571-1: Manufacturer: Kemet; Dielectric: X7R; Value: 47nF ±10% 16V; OrderingCode: C0402C473K4RAC; Temp_ Max: 125; Temp_ Min: -55; SchLibComponentName: Capacitor; Part Number: C0402_47nF_16V_±10%; Price units: EUR
R23 = CMP-A1835-1: Manufacturer: Vishay; Value: 100k ±1% 0.063W; OrderingCode: CRCW0402100KFK; Power: 0.063W; Temp_ Max: 155; Temp_ Min: -55; SchLibComponentName: Resistor; PackageDescription: SMD; Part Number: R0402_100k_0.063W_±1%; Price units: EUR
R24 = CMP-A1912-2: Manufacturer: Vishay; Value: 30k ±1% 0.063W; OrderingCode: CRCW040230K0FK; Power: 0.063W; Temp_ Max: 155; Temp_ Min: -55; Description ES: Resistencia; SchLibComponentName: Resistor; PackageDescription: SMD; Part Number: R0402_30k_0.063W_±1%; Price units: EUR
R25 = CMP-A1837-1: as R22 on sheet MP1477H_DCDC_5V; SchLibComponentName: Resistor; PackageDescription: SMD; Part Number: R0402_10k_0.063W_±1%; Price units: EUR
TP7 = CMP-A2499-3: as TP8 on sheet ZUM_Junior; SchLibComponentName: Testpoint; Part Number: TP_POWER; Price units: EUR
U4 = CMP-00392-2: LDO Vin: 3-40V Vout: 1.2-15V @300mA; Manufacturer: Monolithic Power Systems; Temp_Max: 150; Temp_Min: -40; Description ES: LDO Vin: 3-40V Vout: 1.2-15V @300mA; OrderingCode: MP2019GN-Z; Part Number: MP2019GN-Z; Price units: 10000; SchLibComponentName: MP2019

## Nets that join several sheets
5V: ZUM_Junior (7 pins), ATMega328 (6 pins), USB_CP2104 (6 pins), ZUM_Power (Q3.2), MP2019_LDO_5V (5 pins)
5V@3A: ZUM_Junior (6 pins), ZUM_Power (Q2.2), MP1477H_DCDC_5V (6 pins)
+5V_USB: USB_CP2104 (5 pins), ZUM_Power (Q2.3 Q3.3)
GND: ZUM_Junior (17 pins), ATMega328 (8 pins), USB_CP2104 (15 pins), ZUM_Power (R15.1), MP1477H_DCDC_5V (6 pins), MP2019_LDO_5V (6 pins)
Vin: ZUM_Junior (L3.2 Vin.1), ZUM_Power (D3.A D5.A R16.1)
Vin_DCDC: ZUM_Power (D3.k), MP1477H_DCDC_5V (C7.2 C8.2 R7.2 U2.1)
A0: ZUM_Junior (J1.2 TP11.1), ATMega328 (U1.23)
A1: ZUM_Junior (J2.2 TP17.1), ATMega328 (U1.24)
A2: ZUM_Junior (J5.2 TP13.1), ATMega328 (U1.25)
A3: ZUM_Junior (J6.2 TP19.1), ATMega328 (U1.26)
A4: ZUM_Junior (J4.3 TP15.1), ATMega328 (U1.27)
A5: ZUM_Junior (J4.2 TP18.1), ATMega328 (U1.28)
D2: ZUM_Junior (R19.1), ATMega328 (U1.32)
D3: ZUM_Junior (J6.3 TP16.1), ATMega328 (U1.1)
D4: ZUM_Junior (R4.1), ATMega328 (U1.2)
D5: ZUM_Junior (J1.3 TP8.1), ATMega328 (U1.9)
D6: ZUM_Junior (J2.3 TP14.1), ATMega328 (U1.10)
D7: ZUM_Junior (R21.1), ATMega328 (U1.11)
D8: ZUM_Junior (R20.1), ATMega328 (U1.12)
D9: ZUM_Junior (J5.3 TP10.1), ATMega328 (U1.13)
~{MCU_RES}: ZUM_Junior (TP30.1), ATMega328 (U1.29), USB_CP2104 (C18.1 D1.3 R10.2 R12.1)
NetC23_2: ZUM_Power (D5.k), MP2019_LDO_5V (C23.2 U4.4 U4.5)
RX: ATMega328 (U1.30), USB_CP2104 (U3.21)
SCL1: ZUM_Junior (J3.2 TP12.1), ATMega328 (U1.6)
SDA1: ZUM_Junior (J3.3 TP9.1), ATMega328 (U1.3)
SPI_MISO: ZUM_Junior (TP25.1), ATMega328 (U1.16)
SPI_MOSI: ZUM_Junior (TP28.1), ATMega328 (U1.15)
SPI_SCK: ZUM_Junior (TP27.1), ATMega328 (U1.17)
TX: ATMega328 (U1.31), USB_CP2104 (U3.20)

## Assembly variants
ZUM_Junior: not fitted Buzzer C22 R5 R6 R9 RX TX